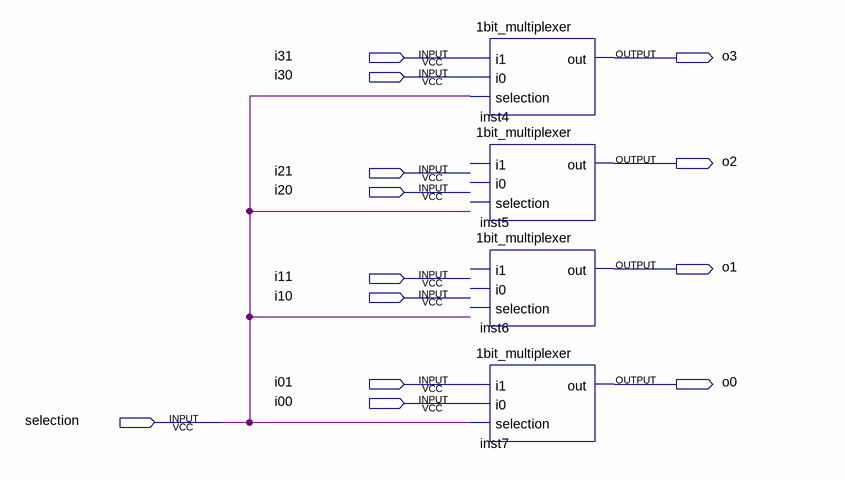
[diagram p0: schematic sheet]
// Quartus schematic 4bit_multiplexer.bdf as structural Verilog: 4 symbols, 13 pins
module \4bit_multiplexer  (
  input  i31,
  input  i30,
  input  i21,
  input  i20,
  input  i11,
  input  i10,
  input  i01,
  input  i00,
  input  selection,
  output o3,
  output o2,
  output o1,
  output o0
);

  \1bit_multiplexer  inst4 (.i1(i31), .i0(i30), .selection(selection), .out(o3));
  \1bit_multiplexer  inst5 (.out(o2));  // open: i1, i0, selection
  \1bit_multiplexer  inst6 (.out(o1));  // open: i1, i0, selection
  \1bit_multiplexer  inst7 (.i1(i01), .i0(i00), .selection(selection), .out(o0));
endmodule
